# Altium schematic sheet SlowDanceGift.SchDoc
size A3
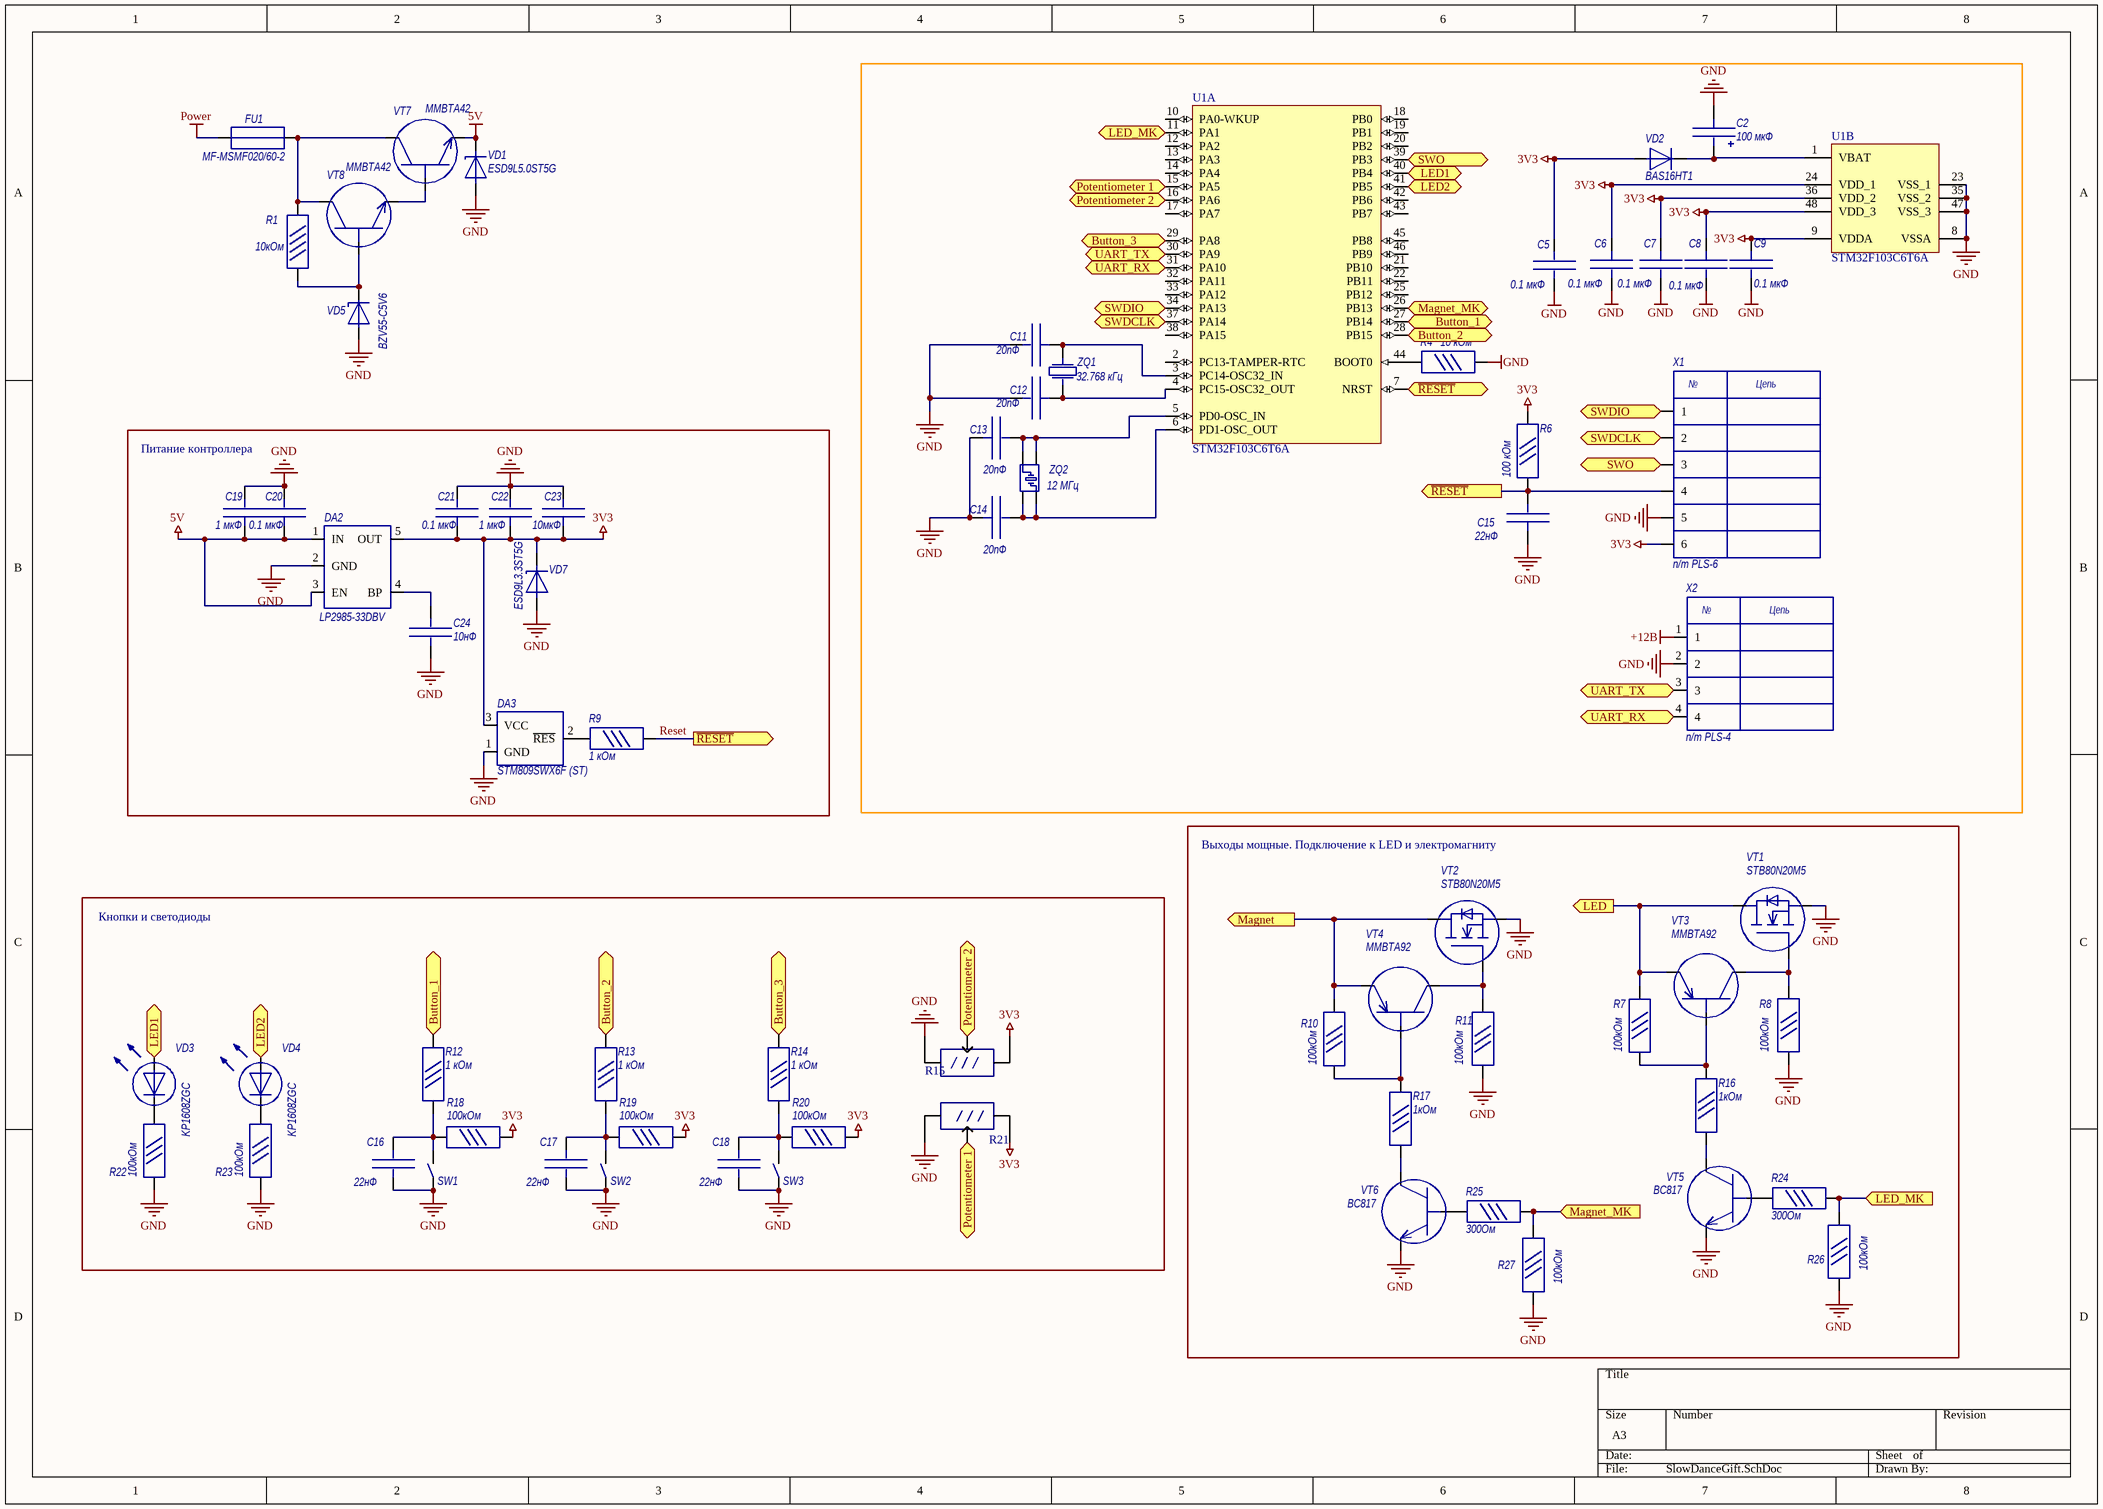
[diagram p0: SlowDanceGift.SchDoc]

## Parts
C2  value 100 мкФ  [CAP_POL_SIZE_B]  (hidden comment: Tann B 100 мкФ 6 В)
C5  value 0.1 мкФ  [C0603_HD]  (hidden comment: C0603-X7R-50В-0.1мкФ)
C6  value 0.1 мкФ  [C0603_HD]  (hidden comment: C0603-X7R-50В-0.1мкФ)
C7  value 0.1 мкФ  [C0603_HD]  (hidden comment: C0603-X7R-50В-0.1мкФ)
C8  value 0.1 мкФ  [C0603_HD]  (hidden comment: C0603-X7R-50В-0.1мкФ)
C9  value 0.1 мкФ  [C0603_HD]  (hidden comment: C0603-X7R-50В-0.1мкФ)
C11  value 20пФ  [C0402_HD]  (hidden comment: C0402-X7R-16В-20pF-10%)
C12  value 20пФ  [C0402_HD]  (hidden comment: C0402-X7R-16В-20pF-10%)
C13  value 20пФ  [C0402_HD]  (hidden comment: C0402-X7R-16В-20pF-10%)
C14  value 20пФ  [C0402_HD]  (hidden comment: C0402-X7R-16В-20pF-10%)
C15  value 22нФ  [C0603_HD]  (hidden comment: C0603-X5R-16В-22нФ)
C16  value 22нФ  [C0603_HD]  (hidden comment: C0603-X5R-16В-22нФ)
C17  value 22нФ  [C0603_HD]  (hidden comment: C0603-X5R-16В-22нФ)
C18  value 22нФ  [C0603_HD]  (hidden comment: C0603-X5R-16В-22нФ)
C19  value 1 мкФ  [C0603_HD]  (hidden comment: C0603-X5R-16В-1мкФ)
C20  value 0.1 мкФ  [C0603_HD]  (hidden comment: C0603-X5R-16В-0.1мкФ)
C21  value 0.1 мкФ  [C0603_HD]  (hidden comment: C0603-X5R-16В-0.1мкФ)
C22  value 1 мкФ  [C0603_HD]  (hidden comment: C0603-X5R-16В-1мкФ)
C23  value 10мкФ  [C0603_HD]  (hidden comment: C0603-X5R-16В-10мФ)
C24  value 10нФ  [C0402_HD]  (hidden comment: C0402-X7R-16В-10nF-10%)
DA2  LP2985-33DBV  [SOT-23-5 (TI)]
DA3  STM809SWX6F (ST)  [SOT-23]
FU1  MF-MSMF020/60-2  [MF-MSMF020/60]
R1  value 10кОм  [R0402_min]  (hidden comment: R0402-10кОм-5%)
R4  value 10 кОм  [R0603_HD]  (hidden comment: R0603-10кОм-5%)
R6  value 100 кОм  [R0603_HD]  (hidden comment: R0603-100кОм-5%)
R7  value 100кОм  [R0603_HD]  (hidden comment: R0603-100кОм-5%)
R8  value 100кОм  [R0603_HD]  (hidden comment: R0603-100кОм-5%)
R9  value 1 кОм  [R0603_HD]  (hidden comment: R0603-1кОм-5%)
R10  value 100кОм  [R0603_HD]  (hidden comment: R0603-100кОм-5%)
R11  value 100кОм  [R0603_HD]  (hidden comment: R0603-100кОм-5%)
R12  value 1 кОм  [R0603_HD]  (hidden comment: R0603-1кОм-5%)
R13  value 1 кОм  [R0603_HD]  (hidden comment: R0603-1кОм-5%)
R14  value 1 кОм  [R0603_HD]  (hidden comment: R0603-1кОм-5%)
R15  R-0904N  [R-0904N]  (value not drawn)
R16  value 1кОм  [R0603_HD]  (hidden comment: R0603-1кОм-5%)
R17  value 1кОм  [R0603_HD]  (hidden comment: R0603-1кОм-5%)
R18  value 100кОм  [R0603_HD]  (hidden comment: R0603-100кОм-5%)
R19  value 100кОм  [R0603_HD]  (hidden comment: R0603-100кОм-5%)
R20  value 100кОм  [R0603_HD]  (hidden comment: R0603-100кОм-5%)
R21  R-0904N  [R-0904N]  (value not drawn)
R22  value 100кОм  [R0603_HD]  (hidden comment: R0603-100кОм-5%)
R23  value 100кОм  [R0603_HD]  (hidden comment: R0603-100кОм-5%)
R24  value 300Ом  [R0603_HD]  (hidden comment: R0603-300Ом-5%)
R25  value 300Ом  [R0603_HD]  (hidden comment: R0603-300Ом-5%)
R26  value 100кОм  [R0603_HD]  (hidden comment: R0603-100кОм-5%)
R27  value 100кОм  [R0603_HD]  (hidden comment: R0603-100кОм-5%)
SW1  SWT-30  [SWT-30]  (value not drawn)
SW2  SWT-30  [SWT-30]  (value not drawn)
SW3  SWT-30  [SWT-30]  (value not drawn)
U1  STM32F103C6T6A  [STM-LQFP48_N]  (parts A,B of 2)
VD1  ESD9L5.0ST5G  [SOD-923 (ON)]
VD2  BAS16HT1  [SOD323 (SC-76)]
VD3  KP1608ZGC  [LED_0603]
VD4  KP1608ZGC  [LED_0603]
VD5  BZV55-C5V6  [sod80c]
VD7  ESD9L3.3ST5G  [SOD-923 (ON)]
VT1  STB80N20M5  [D2PAK-2 (ST)]
VT2  STB80N20M5  [D2PAK-2 (ST)]
VT3  MMBTA92  [SOT-23]
VT4  MMBTA92  [SOT-23]
VT5  BC817  [SOT-23]
VT6  BC817  [SOT-23]
VT7  MMBTA42  [SOT-23]
VT8  MMBTA42  [SOT-23]
X1  n/m PLS-6  [PLS-06]
X2  n/m PLS-4  [PLS2-4]
ZQ1  value 32.768 кГц  [DST310S]  (hidden comment: DST310S 32.768 kHz, 20ppm, 50 kOhm, 7pF (1TJF0SPDJ1AI00D))
ZQ2  value 12 МГц  [DSX321G]  (hidden comment: DSX321G 12 MHz, 10ppm@25C, 20ppm@-40+85C, 80 Ohm, 12pF (1C212000AB0AB))

## Blocks framed on the sheet
Питание контроллера: C19-C24 DA2 DA3 R9 VD7
Выходы мощные. Подключение к LED и электромагниту: R7 R8 R10 R11 R16 R17 R24-R27 VT1-VT6
Кнопки и светодиоды: C16-C18 R12-R15 R18-R23 SW1-SW3 VD3 VD4

## Ports
Button_1 (out), Button_2 (out), Button_3 (out), LED1 (in), LED1 (out), LED2 (in), LED2 (out), LED (out), LED_MK (in), LED_MK (out), Magnet (out), Magnet_MK (in), Magnet_MK (out), Potentiometer 1 (in), Potentiometer 1 (out), Potentiometer 2 (in), Potentiometer 2 (out), SWDCLK, SWDIO, SWO, UART_RX (in), UART_RX (out), UART_TX (in), UART_TX (out), ~{RESET} (in), ~{RESET} (out)

## Nets
3V3: C5.1 C6.1 C7.1 C8.1 C9.1 C21.2 C22.2 C23.2 DA2.5(OUT) DA3.3(VCC) R6.1 R15.1 R18.1 R19.1 R20.1 R21.3 U1.9(VDDA) U1.24(VDD_1) U1.36(VDD_2) U1.48(VDD_3) VD2.1(A) VD7.1(C) X1.6
5V: C19.2 C20.2 DA2.1(IN) DA2.3(EN) VD1.1(C) VT7.2(E)
+12В: X2.1
GND: C2.2(-) C5.2 C6.2 C7.2 C8.2 C9.2 C11.2 C12.2 C13.2 C14.2 C15.2 C16.2 C17.2 C18.2 C19.1 C20.1 C21.1 C22.1 C23.1 C24.1 DA2.2(GND) DA3.1(GND) R4.1 R8.2 R11.2 R15.3 R21.1 R22.1 R23.1 R26.1 R27.1 SW1.1 SW2.1 SW3.1 U1.8(VSSA) U1.23(VSS_1) U1.35(VSS_2) U1.47(VSS_3) VD1.2(A) VD5.1(A) VD7.2(A) VT1.3(S) VT2.3(S) VT5.2(E) VT6.2(E) X1.5 X2.2
Power: FU1.1
Button_1: R12.1 U1.27(PB14) ; port Button_1
Button_2: R13.1 U1.28(PB15) ; port Button_2
Button_3: R14.1 U1.29(PA8) ; port Button_3
LED: R7.2 VT1.2(D) VT3.2(E) ; port LED
LED1: U1.40(PB4) VD3.1(A) ; port LED1
LED2: U1.41(PB5) VD4.1(A) ; port LED2
LED_MK: R24.1 R26.2 U1.11(PA1) ; port LED_MK
Magnet: R10.2 VT2.2(D) VT4.2(E) ; port Magnet
Magnet_MK: R25.1 R27.2 U1.26(PB13) ; port Magnet_MK
Potentiometer 1: R21.2 U1.15(PA5) ; port Potentiometer 1
Potentiometer 2: R15.2 U1.16(PA6) ; port Potentiometer 2
Reset: C15.1 R6.2 R9.1 U1.7(NRST) X1.4 ; port ~{RESET}
SWDCLK: U1.37(PA14) X1.2 ; port SWDCLK
SWDIO: U1.34(PA13) X1.1 ; port SWDIO
SWO: U1.39(PB3) X1.3 ; port SWO
UART_RX: U1.31(PA10) X2.4 ; port UART_RX
UART_TX: U1.30(PA9) X2.3 ; port UART_TX
NetC2_1: C2.1(+) U1.1(VBAT) VD2.2(K)
NetC11_1: C11.1 U1.3(PC14-OSC32_IN) ZQ1.1
NetC12_1: C12.1 U1.4(PC15-OSC32_OUT) ZQ1.2
NetC13_1: C13.1 U1.5(PD0-OSC_IN) ZQ2.2 ZQ2.3
NetC14_1: C14.1 U1.6(PD1-OSC_OUT) ZQ2.1 ZQ2.4
NetC16_1: C16.1 R12.2 R18.2 SW1.2
NetC17_1: C17.1 R13.2 R19.2 SW2.2
NetC18_1: C18.1 R14.2 R20.2 SW3.2
NetC24_2: C24.2 DA2.4(BP)
NetDA3_2: DA3.2(~{RES}) R9.2
NetFU1_2: FU1.2 R1.2 VT7.3(C) VT8.3(C)
NetR1_1: R1.1 VD5.2(C) VT8.1(B)
NetR4_2: R4.2 U1.44(BOOT0)
NetR7_1: R7.1 R16.2 VT3.1(B)
NetR8_1: R8.1 VT1.1(G) VT3.3(C)
NetR10_1: R10.1 R17.2 VT4.1(B)
NetR11_1: R11.1 VT2.1(G) VT4.3(C)
NetR16_1: R16.1 VT5.3(C)
NetR17_1: R17.1 VT6.3(C)
NetR22_2: R22.2 VD3.2(C)
NetR23_2: R23.2 VD4.2(C)
NetR24_2: R24.2 VT5.1(B)
NetR25_2: R25.2 VT6.1(B)
NetVT7_1: VT7.1(B) VT8.2(E)

Not connected (* = marked no-connect by the designer): U1 2(PC13-TAMPER-RTC) 10(PA0-WKUP) 12(PA2) 13(PA3) 14(PA4) 17(PA7) 18(PB0) 19(PB1) 20(PB2) 21(PB10) 22(PB11) 25(PB12) 32(PA11) 33(PA12) 38(PA15) 42(PB6) 43(PB7) 45(PB8) 46(PB9)

## Notes on the sheet
- (in symbol PLS2-4) №; Цепь
- (in symbol PLS-6) №; Цепь

## Library data of the parts
C2 = CAP_TANT_B
C5-C9 = C0603
C11-C14 C24 = C0402
C15-C23 = C0603_HD
DA2 = LP2985-xxDBV
DA3 = LM809M3-2.93
FU1 = MF-MSMF
R1 = R0402
R4 R6-R14 R16-R20 R22-R27 = R0603
R15 R21 = R-0904N: R-0904N-A100K resistor 500omh-100komh; Max value: 100кОм; Min value: 500Ом; Rated power: 50mW; Tolerance: 20%; Rot.angle: 280 +- 10
U1 = STM32F103C6T6A: ARM Cortex-M3 32-bit MCU, 32 KB Flash, 10 KB Internal RAM, 37 I/Os, 48-pin LQFP, -40 to 85 degC, Tray; A/D Converter: 2x12-bit (10 Channel); FLASH Size (Prog) (kB): 32; I/Os (High Current): 37; Internal RAM Size (kB): 10; Operating Frequency(F) (Processor speed) (MHz): 72; Supply Voltage(Vcc) min (V): 2; DatasheetVersion: Rev. 6; PackageVersion: Rev. 6, 06/2013; PackageReference: LQFP48; PackageDescription: 48-Pin Low Profile Quad Flat Package, 7 x 7 mm Body, 0.5 mm Pitch; Supplier 1: Digi-Key; Supplier Part Number 1: 497-11515-ND; Supplier 2: Farnell; Supplier Part Number 2: 1972391; Supplier 3: Newark; Supplier Part Number 3: 72T2643; Supplier 4: Newark; Supplier Part Number 4: 57P1219; Supplier 5: Mouser; Supplier Part Number 5: 511-STM32F103C6T6A; Core: ARM Cortex-M3; Packing: Tray; Mounting Technology: Surface Mount; PartNumber: STM32F103C6T6A; ComponentLink1Description: Manufacturer URL; ComponentLink1URL: http://www.st.com/web/en/home.html; ComponentLink2Description: Datasheet; ComponentLink2URL: http://www.st.com/st-web-ui/static/active/en/resource/technical/document/datasheet/CD00210843.pdf; ComponentLink3Description: Package Specification; ComponentLink3URL: http://www.st.com/st-web-ui/static/active/en/resource/technical/document/datasheet/DM00058181.pdf
VD2 = BAS16H
VD3 VD4 = LED_0603
VD5 = BZV55
VT3 VT4 = MMBT5401
VT7 VT8 = MMBT5551
X1 = PLS-6
X2 = PLS2-4
ZQ2 = DSX321G